# EAGLE design 3rdLayer-V2 (EAGLE 8.6.3)
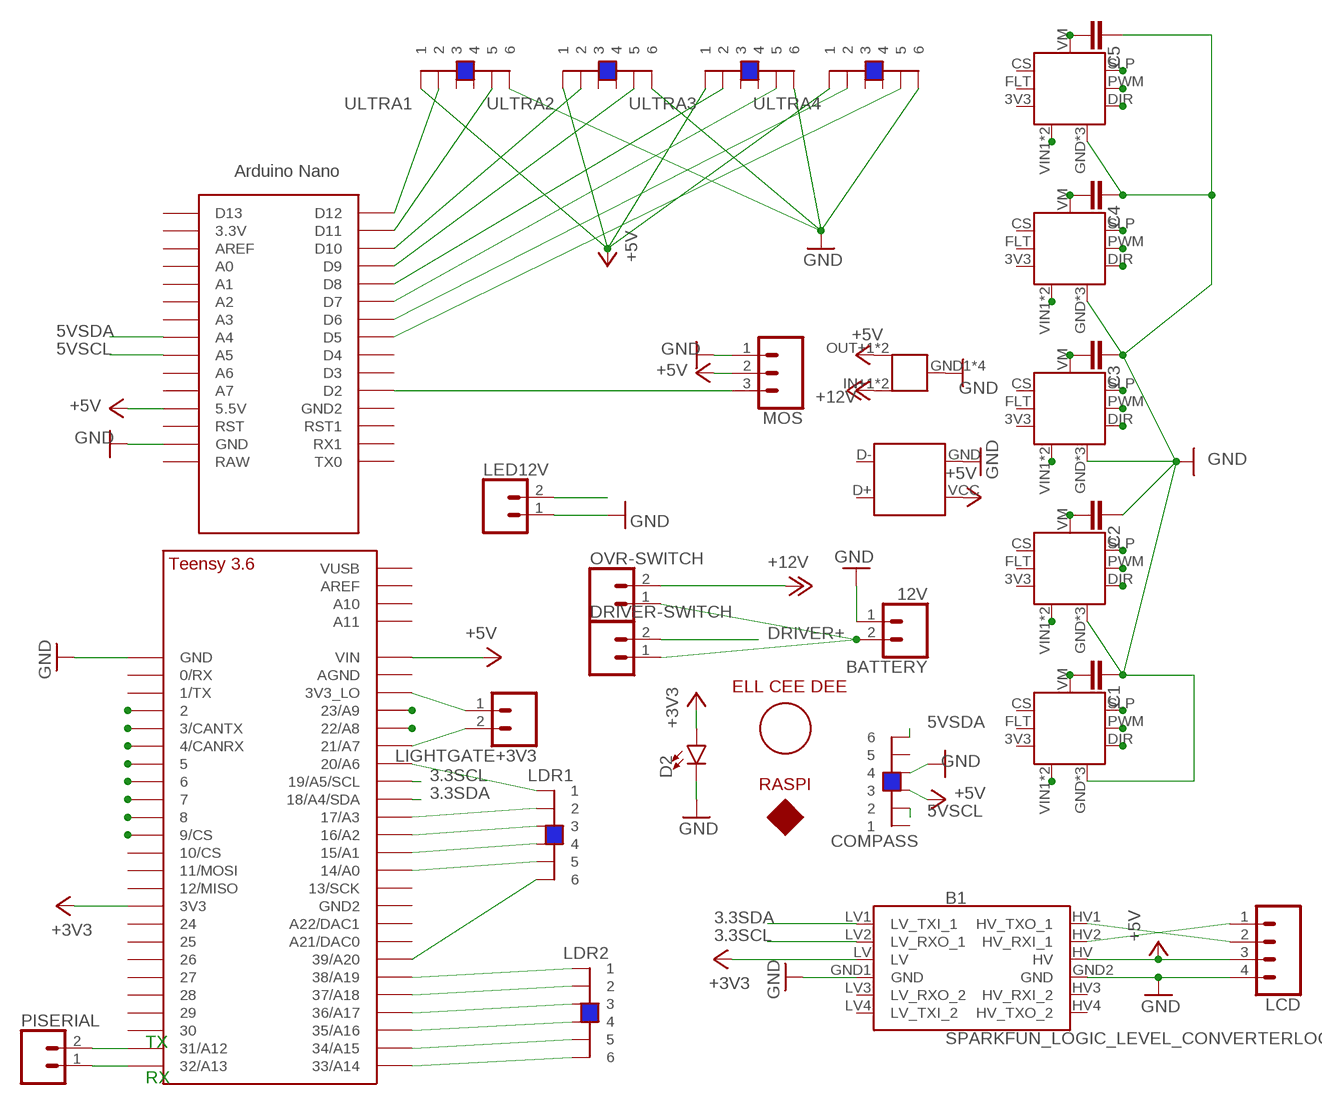
[diagram p0: schematic, sheet 1]

## Parts
B1  SPARKFUN_LOGIC_LEVEL_CONVERTERLOCK  [SPARKFUN_LOGIC_LEVEL_CONVERTER_LOCK]
BATTERY  12V  CONN_023.5MM_LOCK  [SCREWTERMINAL-3.5MM-2_LOCK]
C1  C5/7.2  [C5B7.2]
C2  C5/7.2  [C5B7.2]
C3  C5/7.2  [C5B7.2]
C4  C5/7.2  [C5B7.2]
C5  C5/7.2  [C5B7.2]
COMPASS  6P6C_FEMALESMD  [6P6C_FEMALE]
D2  LED-3MM-NO_SILK  [LED_3MM-NS]
DRIVER-SWITCH  CONN_023.5MM_LOCK  [SCREWTERMINAL-3.5MM-2_LOCK]
LCD  CONN_04LOCK_LONGPADS  [1X04_LOCK_LONGPADS]
LCD1  LCD-16X2SILK  [LCD-16X2]
LDR1  6P6C_FEMALESMD  [6P6C_FEMALE]
LDR2  6P6C_FEMALESMD  [6P6C_FEMALE]
LED12V  CONN_023.5MM_LOCK  [SCREWTERMINAL-3.5MM-2_LOCK]
LIGHTGATE+3V3  CONN_02LOCK_LONGPADS  [1X02_LOCK_LONGPADS]
MOS  CONN_03LOCK_LONGPADS  [1X03_LOCK_LONGPADS]
OVR-SWITCH  CONN_023.5MM_LOCK  [SCREWTERMINAL-3.5MM-2_LOCK]
PCB1  RPI3  [RPI3]
PISERIAL  CONN_02LOCK_LONGPADS  [1X02_LOCK_LONGPADS]
RPI  USBA  [USBA]
U$1  TEENSY_3.5/3.6_BASIC  [TEENSY_3.5/3.6_BASIC]
U$2  NANO  [NANO]
U$3  18V17  [18V17]
U$4  18V17  [18V17]
U$5  18V17  [18V17]
U$6  18V17  [18V17]
U$7  18V17  [18V17]
U$8  5VSTEPDOWN  [5VSTEPDOWN]
ULTRA1  6P6C_FEMALESMD  [6P6C_FEMALE]
ULTRA2  6P6C_FEMALESMD  [6P6C_FEMALE]
ULTRA3  6P6C_FEMALESMD  [6P6C_FEMALE]
ULTRA4  6P6C_FEMALESMD  [6P6C_FEMALE]

## Nets
3.3SCL: B1.LV2(LV_RXO_1) U$1.19/A5/SCL
3.3SDA: B1.LV1(LV_TXI_1) U$1.18/A4/SDA
5VSCL: B1.HV2(HV_RXI_1) COMPASS.2 LCD.1 U$2.A5
5VSDA: B1.HV1(HV_TXO_1) COMPASS.6 LCD.2 U$2.A4
+3V3: B1.LV D2.A U$1.3V3
+5V: B1.HV COMPASS.3 LCD.3 MOS.2 RPI.VCC U$1.VIN U$2.5V(5.5V) U$3.SLP U$4.SLP U$5.SLP U$6.SLP U$7.SLP U$8.OUT+1(5VOUT) U$8.OUT+2(5VOUT) ULTRA1.1 ULTRA2.1 ULTRA3.1 ULTRA4.1
+12V: OVR-SWITCH.2 U$8.IN+1(IN+) U$8.IN+2(IN+)
DIR1: U$1.6 U$3.DIR
DIR2: U$1.7 U$4.DIR
DIR3: U$1.8 U$5.DIR
DIR4: U$1.9/CS U$6.DIR
DIR5: U$1.22/A8 U$7.DIR
DRIVER+: DRIVER-SWITCH.2 LED12V.2 U$3.VIN1(VIN) U$3.VIN2(VIN) U$4.VIN1(VIN) U$4.VIN2(VIN) U$5.VIN1(VIN) U$5.VIN2(VIN) U$6.VIN1(VIN) U$6.VIN2(VIN) U$7.VIN1(VIN) U$7.VIN2(VIN)
GND: B1.GND1(GND) B1.GND2(GND) BATTERY.1 C1.1 C2.1 C3.1 C4.1 C5.1 COMPASS.4 D2.K(C) LCD.4 LED12V.1 MOS.1 RPI.GND U$1.GND U$2.GND U$3.GND U$3.GND1(GND) U$3.GND2(GND) U$4.GND U$4.GND1(GND) U$4.GND2(GND) U$5.GND U$5.GND1(GND) U$5.GND2(GND) U$6.GND U$6.GND1(GND) U$6.GND2(GND) U$7.GND U$7.GND1(GND) U$7.GND2(GND) U$8.GND1(GND) U$8.GND2(GND) U$8.GND3(GND) U$8.GND4(GND) ULTRA1.6 ULTRA2.6 ULTRA3.6 ULTRA4.6
N$1: LDR1.6 U$1.39/A20
N$2: PISERIAL.2 U$1.31/A12
N$3: PISERIAL.1 U$1.32/A13
N$4: MOS.3 U$2.D2
N$6: LDR1.5 U$1.14/A0
N$7: LDR1.4 U$1.15/A1
N$8: LDR1.3 U$1.16/A2
N$9: LDR1.2 U$1.17/A3
N$10: LDR1.1 U$1.20/A6
N$13: LIGHTGATE+3V3.2 U$1.21/A7
N$16: C1.2 U$3.VM
N$18: LDR2.1 U$1.38/A19
N$19: LDR2.2 U$1.37/A18
N$20: LDR2.3 U$1.36/A17
N$21: LDR2.4 U$1.35/A16
N$22: LDR2.5 U$1.34/A15
N$23: LDR2.6 U$1.33/A14
N$26: U$2.D12 ULTRA1.2
N$27: BATTERY.2 DRIVER-SWITCH.1 OVR-SWITCH.1
N$28: U$2.D11 ULTRA1.5
N$29: U$2.D10 ULTRA2.2
N$30: U$2.D9 ULTRA2.5
N$31: C2.2 U$4.VM
N$32: LIGHTGATE+3V3.1 U$1.3V3_LO
N$33: C3.2 U$5.VM
N$34: C4.2 U$6.VM
N$35: C5.2 U$7.VM
N$39: U$2.D8 ULTRA3.2
N$40: U$2.D7 ULTRA3.5
N$41: U$2.D6 ULTRA4.2
N$42: U$2.D5 ULTRA4.5
PWM1: U$1.2 U$3.PWM
PWM2: U$1.3/CANTX U$4.PWM
PWM3: U$1.4/CANRX U$5.PWM
PWM4: U$1.5 U$6.PWM
PWM5: U$1.23/A9 U$7.PWM
Unconnected: B1.HV3(HV_RXI_2) B1.HV4(HV_TXO_2) B1.LV3(LV_RXO_2) B1.LV4(LV_TXI_2) COMPASS.1 COMPASS.5 RPI.D+ RPI.D- U$1.0/RX U$1.1/TX U$1.10/CS U$1.11/MOSI U$1.12/MISO U$1.13/SCK U$1.21/DAC0(A21/DAC0) U$1.24 U$1.25 U$1.26 U$1.27 U$1.28 U$1.29 U$1.30 U$1.A10 U$1.A11 U$1.A22/DAC1 U$1.AGND U$1.AREF U$1.GND2 U$1.VUSB U$2.3.3V U$2.A0 U$2.A1 U$2.A2 U$2.A3 U$2.A6 U$2.A7 U$2.AREF U$2.D3 U$2.D4 U$2.D13 U$2.GND1(GND2) U$2.RAW U$2.RST U$2.RST1 U$2.RX1 U$2.TX0 U$3.3V3 U$3.CS U$3.FLT U$4.3V3 U$4.CS U$4.FLT U$5.3V3 U$5.CS U$5.FLT U$6.3V3 U$6.CS U$6.FLT U$7.3V3 U$7.CS U$7.FLT ULTRA1.3 ULTRA1.4 ULTRA2.3 ULTRA2.4 ULTRA3.3 ULTRA3.4 ULTRA4.3 ULTRA4.4

## Notes on the sheet
- TX
- RX

## Library data of the parts
B1 = SparkFun-Boards:SPARKFUN_LOGIC_LEVEL_CONVERTER: SparkFun Logic Level Converter -Bi-Directional This is the mechnical outline for the 3.3V - 5V bi directional logic level converter. *Note, the "LOCK" Package has the header pins staggered by an offset of 5 mils (off center line), so that when you slide a row of standard 0.1" headers into the PTH pads, it will hold position vertically. See the follwing turorial for more information on this type of special footprints: Sneaky Footprints <https://www.sparkfun.com/tutorials/114> SparkFun Products: SparkFun Logic Level Converter - Bi-Directional <https://www.sparkfun.com/products/12009>
BATTERY DRIVER-SWITCH LED12V OVR-SWITCH = SparkFun-Connectors:CONN_02: Multi connection point. Often used as Generic Header-pin footprint for 0.1 inch spaced/style header connections On any of the 0.1 inch spaced packages, you can populate with these: Break Away Headers - Straight <https://www.sparkfun.com/products/116> (PRT-00116) Break Away Male Headers - Right Angle <https://www.sparkfun.com/products/553> (PRT-00553) Female Headers <https://www.sparkfun.com/products/115> (PRT-00115) Break Away Headers - Machine Pin <https://www.sparkfun.com/products/117> (PRT-00117) Break Away Female Headers - Swiss Machine Pin <https://www.sparkfun.com/products/743> (PRT-00743) For SCREWTERMINALS and SPRING TERMINALS visit here: Screw Terimnals on SparkFun.com <https://www.sparkfun.com/search/results?term=Screw+Terminals> (5mm/3.5mm/2.54mm spacing) This device is also useful as a general connection point to wire up your design to another part of your project. Our various solder wires solder well into these plated through hole pads. Hook-Up Wire - Assortment (Stranded, 22 AWG) <https://www.sparkfun.com/products/11375> (PRT-11375) Hook-Up Wire - Assortment (Solid Core, 22 AWG) <https://www.sparkfun.com/products/11367> (PRT-11367) View the entire wire category on our website here <https://www.sparkfun.com/categories/141> Special notes: Molex polarized connector foot print use with: PRT-08233 with associated crimp pins and housings. 2.54_SCREWTERM for use with PRT-10571. 3.5mm Screw Terminal footprints for PRT-08084 5mm Screw Terminal footprints for use with PRT-08432; PROD_ID: CONN-08399
C1-C5 = capacitor-wima:C: CAPACITOR naming: grid - package width
COMPASS LDR1 LDR2 ULTRA1-ULTRA4 = Yijiano:6P6C_FEMALE
D2 = SparkFun-LED:LED: LED (Generic) Standard schematic elements and footprints for 5mm, 3mm, 1206, and 0603 sized LEDs. Generic LEDs with no color specified.
LCD = SparkFun-Connectors:CONN_04: Multi connection point. Often used as Generic Header-pin footprint for 0.1 inch spaced/style header connections On any of the 0.1 inch spaced packages, you can populate with these: Break Away Headers - Straight <https://www.sparkfun.com/products/116> (PRT-00116) Break Away Male Headers - Right Angle <https://www.sparkfun.com/products/553> (PRT-00553) Female Headers <https://www.sparkfun.com/products/115> (PRT-00115) Break Away Headers - Machine Pin <https://www.sparkfun.com/products/117> (PRT-00117) Break Away Female Headers - Swiss Machine Pin <https://www.sparkfun.com/products/743> (PRT-00743) For SCREWTERMINALS and SPRING TERMINALS visit here: Screw Terimnals on SparkFun.com <https://www.sparkfun.com/search/results?term=Screw+Terminals> (5mm/3.5mm/2.54mm spacing) This device is also useful as a general connection point to wire up your design to another part of your project. Our various solder wires solder well into these plated through hole pads. Hook-Up Wire - Assortment (Stranded, 22 AWG) <https://www.sparkfun.com/products/11375> (PRT-11375) Hook-Up Wire - Assortment (Solid Core, 22 AWG) <https://www.sparkfun.com/products/11367> (PRT-11367) View the entire wire category on our website here <https://www.sparkfun.com/categories/141> Special notes: Molex polarized connector foot print use with SKU : PRT-08231 with associated crimp pins and housings. 1MM SMD Version SKU: PRT-10208; PROD_ID: CONN-09696
LCD1 = SparkFun-Displays:LCD-16X2: Standard text-only 16x2 parallel input LCD Basic 16 character by 2 line display. Typically utilizes the extremely common HD44780 parallel interface chipset SparkFun Products: Basic 16x2 Green <https://www.sparkfun.com/products/255> Basic 8x2 Green <https://www.sparkfun.com/products/11122>; SF_ID: LCD-00255
LIGHTGATE+3V3 PISERIAL = SparkFun-Connectors:CONN_02: Multi connection point. Often used as Generic Header-pin footprint for 0.1 inch spaced/style header connections On any of the 0.1 inch spaced packages, you can populate with these: Break Away Headers - Straight <https://www.sparkfun.com/products/116> (PRT-00116) Break Away Male Headers - Right Angle <https://www.sparkfun.com/products/553> (PRT-00553) Female Headers <https://www.sparkfun.com/products/115> (PRT-00115) Break Away Headers - Machine Pin <https://www.sparkfun.com/products/117> (PRT-00117) Break Away Female Headers - Swiss Machine Pin <https://www.sparkfun.com/products/743> (PRT-00743) For SCREWTERMINALS and SPRING TERMINALS visit here: Screw Terimnals on SparkFun.com <https://www.sparkfun.com/search/results?term=Screw+Terminals> (5mm/3.5mm/2.54mm spacing) This device is also useful as a general connection point to wire up your design to another part of your project. Our various solder wires solder well into these plated through hole pads. Hook-Up Wire - Assortment (Stranded, 22 AWG) <https://www.sparkfun.com/products/11375> (PRT-11375) Hook-Up Wire - Assortment (Solid Core, 22 AWG) <https://www.sparkfun.com/products/11367> (PRT-11367) View the entire wire category on our website here <https://www.sparkfun.com/categories/141> Special notes: Molex polarized connector foot print use with: PRT-08233 with associated crimp pins and housings. 2.54_SCREWTERM for use with PRT-10571. 3.5mm Screw Terminal footprints for PRT-08084 5mm Screw Terminal footprints for use with PRT-08432
MOS = SparkFun-Connectors:CONN_03: Multi connection point. Often used as Generic Header-pin footprint for 0.1 inch spaced/style header connections On any of the 0.1 inch spaced packages, you can populate with these: Break Away Headers - Straight <https://www.sparkfun.com/products/116> (PRT-00116) Break Away Male Headers - Right Angle <https://www.sparkfun.com/products/553> (PRT-00553) Female Headers <https://www.sparkfun.com/products/115> (PRT-00115) Break Away Headers - Machine Pin <https://www.sparkfun.com/products/117> (PRT-00117) Break Away Female Headers - Swiss Machine Pin <https://www.sparkfun.com/products/743> (PRT-00743) Stackable Header - 3 Pin (Female, 0.1") <https://www.sparkfun.com/products/13875> (PRT-13875) For SCREWTERMINALS and SPRING TERMINALS visit here: Screw Terimnals on SparkFun.com <https://www.sparkfun.com/search/results?term=Screw+Terminals> (5mm/3.5mm/2.54mm spacing) This device is also useful as a general connection point to wire up your design to another part of your project. Our various solder wires solder well into these plated through hole pads. Hook-Up Wire - Assortment (Stranded, 22 AWG) <https://www.sparkfun.com/products/11375> (PRT-11375) Hook-Up Wire - Assortment (Solid Core, 22 AWG) <https://www.sparkfun.com/products/11367> (PRT-11367) View the entire wire category on our website here <https://www.sparkfun.com/categories/141> Special notes: Molex polarized connector foot print use with SKU : PRT-08232 with associated crimp pins and housings.
PCB1 = e14_Rpi3_RevA:RPI3: Device for Raspberry Pi 3 board created by Dave Young for www.element14.com More information and support community is available at https://www.element14.com/community/community/raspberry-pi
RPI = usbA:USBA
U$1 = Teensy356:TEENSY_3.5/3.6_BASIC
U$2 = Arduino-clone:NANO: Arduino Nano
U$3-U$7 = 18v17:18V17
U$8 = 18v17:5VSTEPDOWN

## Board
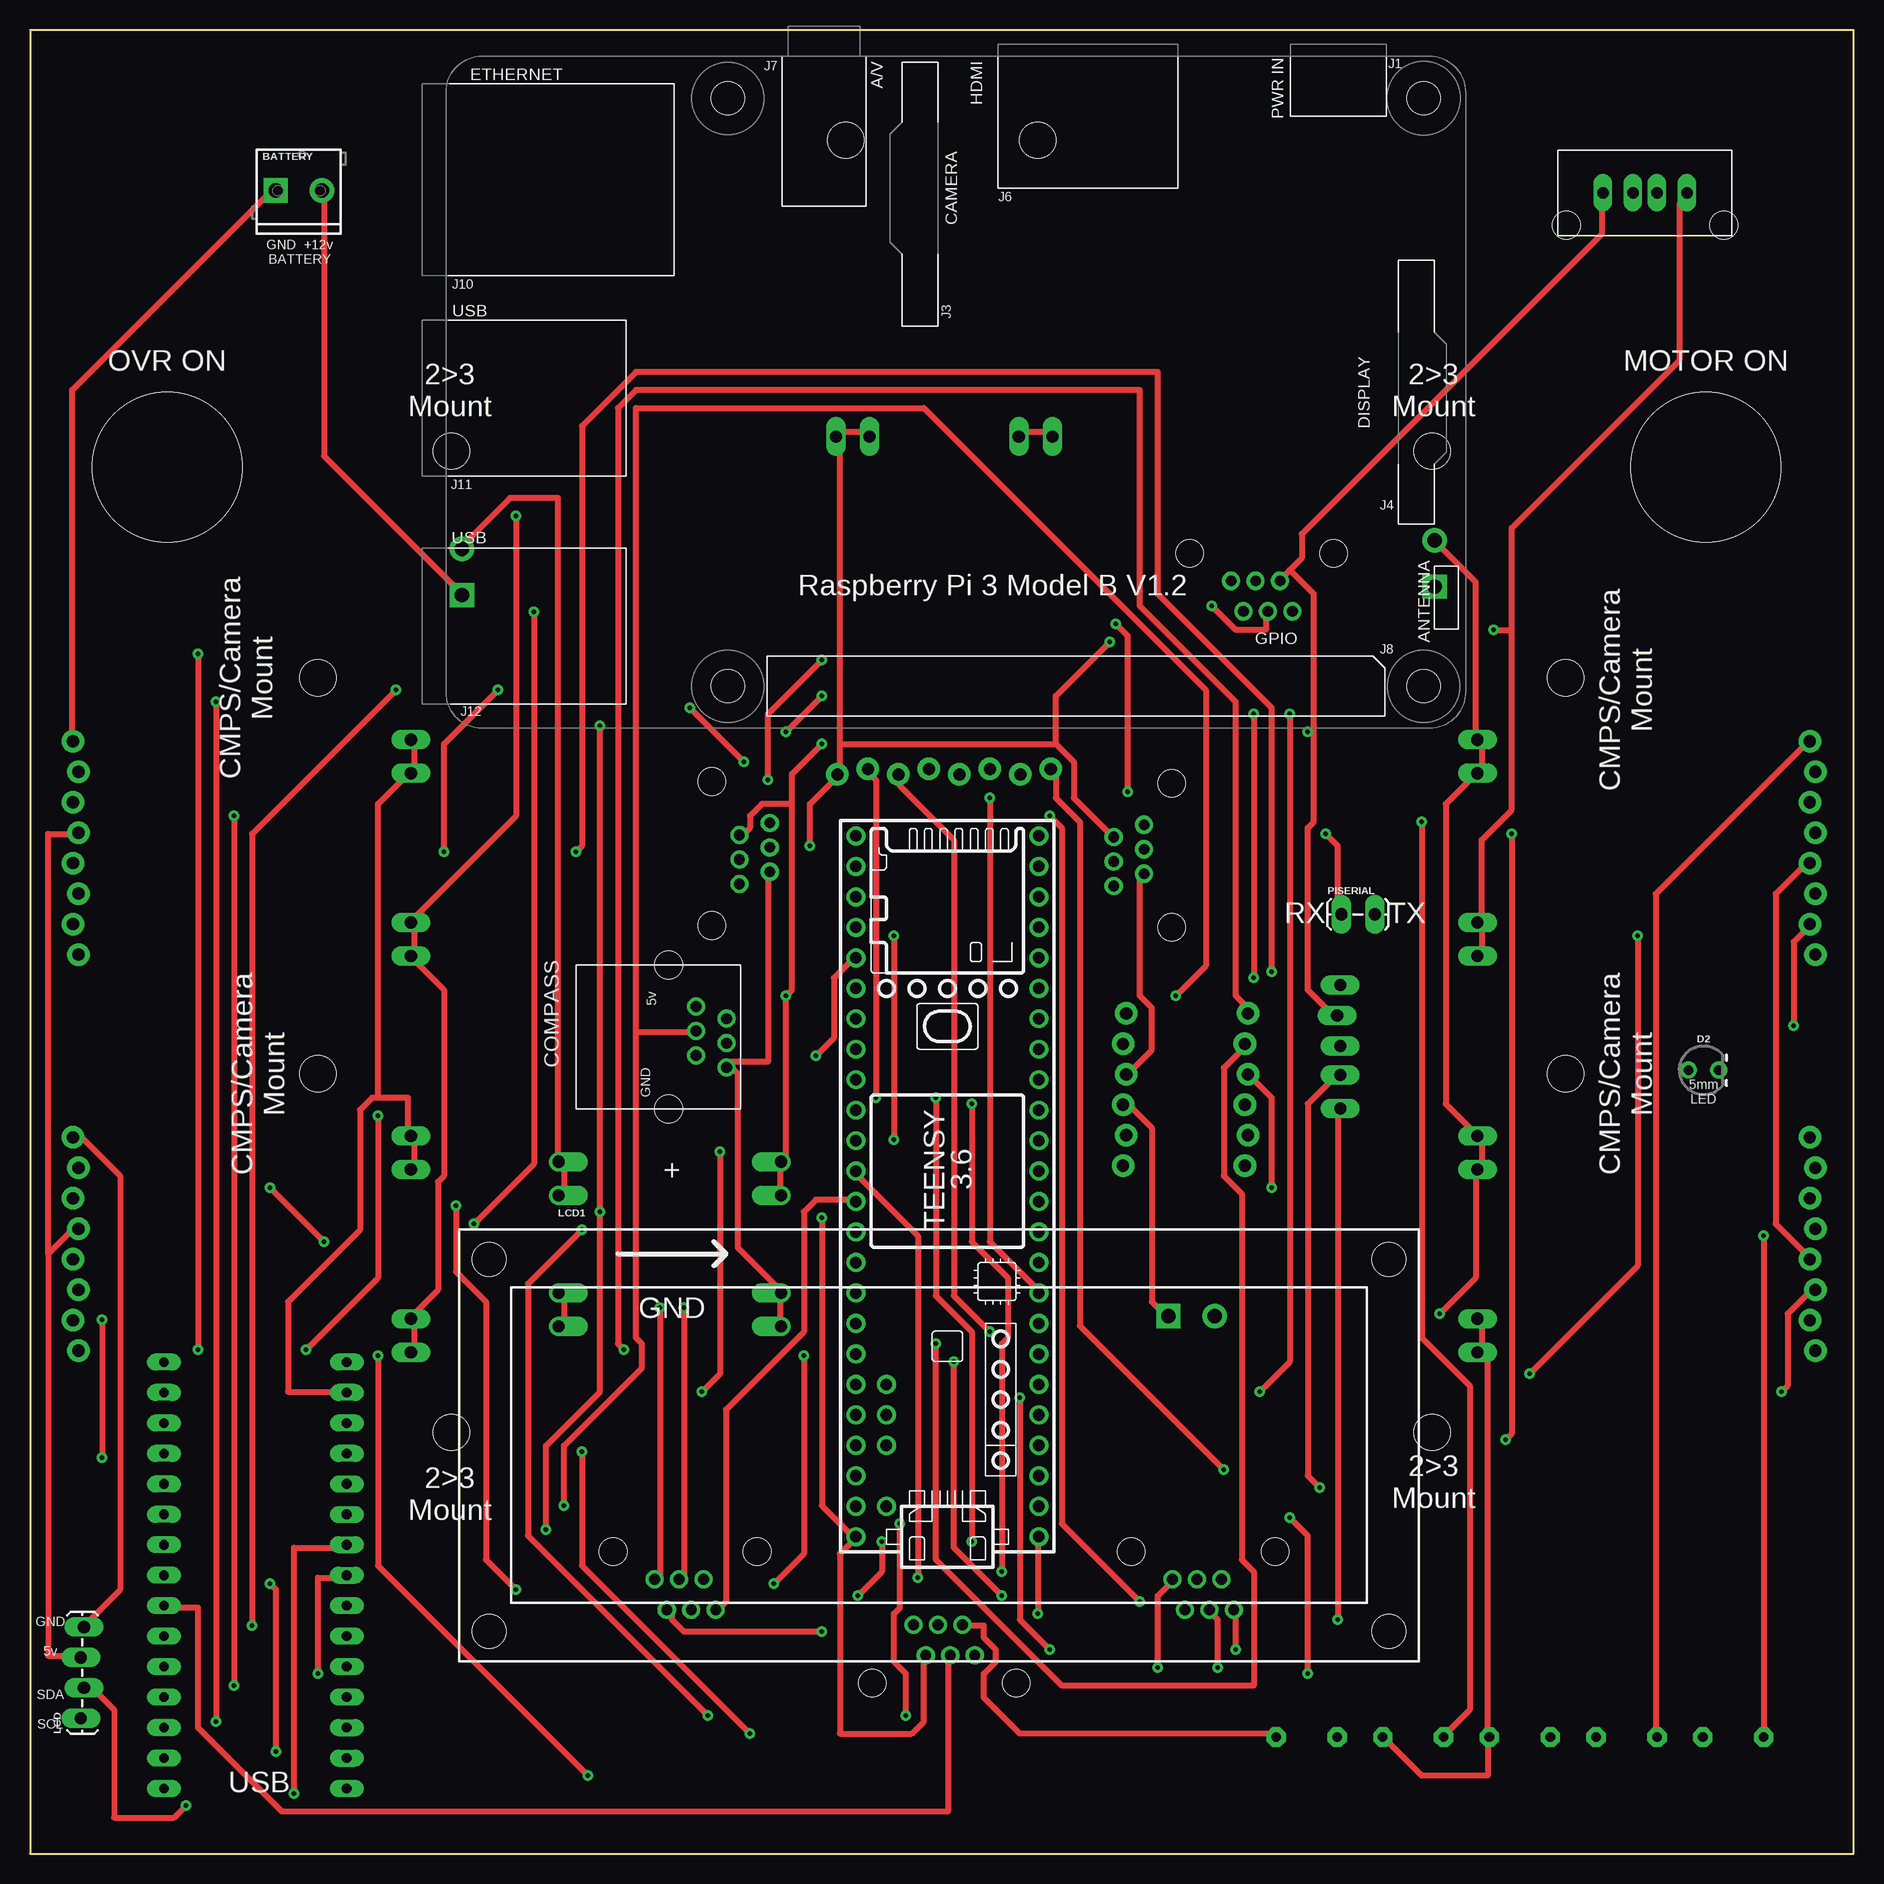
[diagram p1: board, top side]
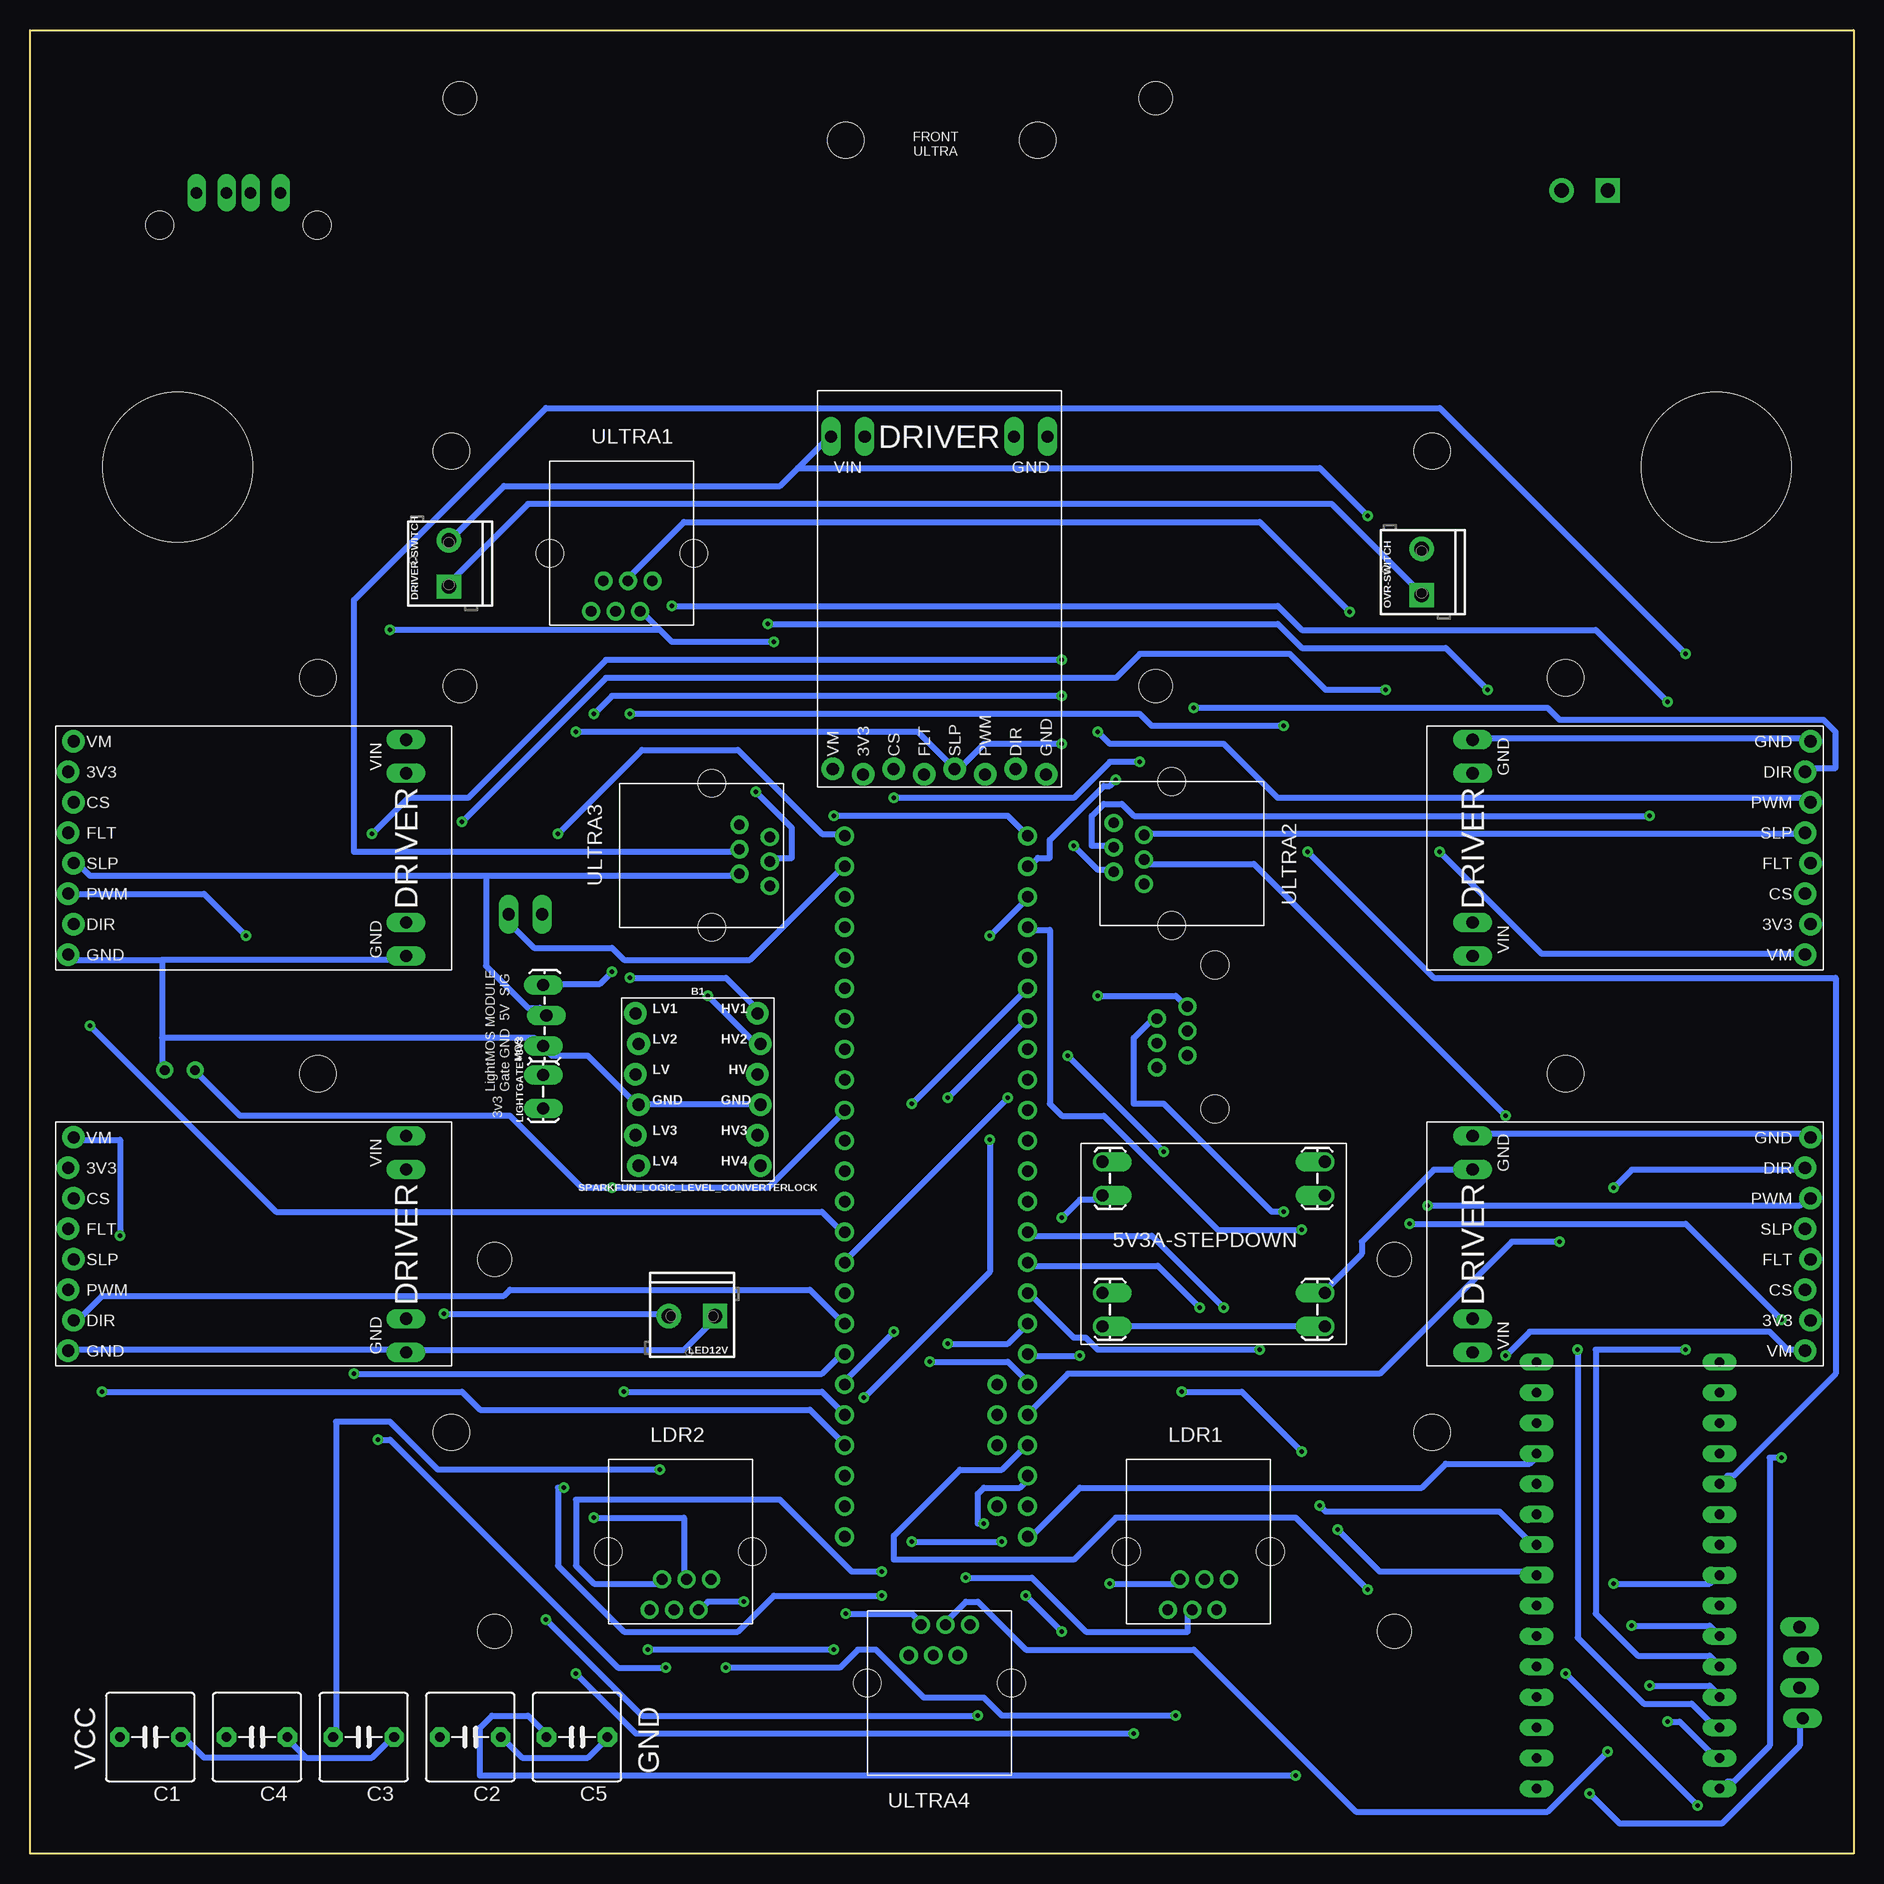
[diagram p2: board, bottom side, seen from below]

Size 152 x 152 mm. Coordinates in mm from the lower left corner, seen from the top.
Outline: 0,0 152,0 152,152 0,152 0,0
Copper layers (1*16): Top 0.035mm / dielectric 1.53mm / Bottom 0.035mm
Design rules "default *": minimum track width 20mil, minimum drill 0.35mm, track to track 20mil, track to pad 20mil, pad to pad 20mil, via to via 20mil, smd to smd 10mil, copper to edge 40mil, drill to drill 10mil, minimum pad ring 12mil, minimum via ring 10mil, stop-mask expansion 4mil, vias tented up to drill 25mil, thermal gap 10mil
Holes 3 mm at 116.88,116.89 35.12,116.89 116.88,35.11 35.12,35.11 84,142.81 68,142.81 128,98 128,65 24,65 24,98
Holes 12.5 mm at 11.43,115.57 139.7,115.57

### Footprints (pad centres in the part's own frame; a part is rotated, then mirrored left to right if it is on the bottom)
SPARKFUN_LOGIC_LEVEL_CONVERTER_LOCK = drill 1.016 pad 1.88: GND1 -4.953,-1.27; GND2 5.207,-1.27; HV 4.953,1.27; HV1 4.953,6.35; HV2 5.207,3.81; HV3 4.953,-3.81; HV4 5.207,-6.35; LV -5.207,1.27; LV1 -5.207,6.35; LV2 -4.953,3.81; LV3 -5.207,-3.81; LV4 -4.953,-6.35
SCREWTERMINAL-3.5MM-2_LOCK = drill 1.2 pad 2.032 square: 1 -0.178,0 | drill 1.2 pad 2.032: 2 3.678,0
C5B7.2 = drill 0.813 pad 1.6 octagon: 1 -2.54,0; 2 2.54,0
6P6C_FEMALE = drill 0.9 pad 1.3: 1 -1.53,1.27; 2 0.51,1.27; 3 2.55,1.27; 4 -2.55,-1.27; 5 -0.51,-1.27; 6 1.53,-1.27 | hole 2.3: -6,3.57; 6,3.57
LED_3MM-NS = drill 0.813: A -1.27,0; K 1.27,0
1X04_LOCK_LONGPADS = drill 1.016 long: 1 0,0; 2 2.54,-0.254; 3 5.08,0; 4 7.62,-0.254
LCD-16X2 = hole 2.8: -37.5,15.5; -37.5,-15.5; 37.5,15.5; 37.5,-15.5
1X02_LOCK_LONGPADS = drill 1.016 long: 1 -0.127,0; 2 2.667,0
1X03_LOCK_LONGPADS = drill 1.016 long: 1 0,0; 2 2.54,-0.254; 3 5.08,0
RPI3 = hole 2.75: 3.5,3.5; 61.5,3.5; 3.5,52.5; 61.5,52.5
USBA = drill 0.95 long: D+ 1,0; D- -1,0; GND 3.5,0; VCC -3.5,0 | hole 2.3: 6.57,-2.71; -6.57,-2.71
TEENSY_3.5/3.6_BASIC = drill 0.965: 0/RX -25.4,-7.62; 1/TX -22.86,-7.62; 2 -20.32,-7.62; 3/CANTX -17.78,-7.62; 3V3 7.62,-7.62; 3V3_LO -22.86,7.62; 4/CANRX -15.24,-7.62; 5 -12.7,-7.62; 6 -10.16,-7.62; 7 -7.62,-7.62; 8 -5.08,-7.62; 9/CS -2.54,-7.62; 10/CS 0,-7.62; 11/MOSI 2.54,-7.62; 12/MISO 5.08,-7.62; 13/SCK 5.08,7.62; 14/A0 2.54,7.62; 15/A1 0,7.62; 16/A2 -2.54,7.62; 17/A3 -5.08,7.62; 18/A4/SDA -7.62,7.62; 19/A5/SCL -10.16,7.62; 20/A6 -12.7,7.62; 21/A7 -15.24,7.62; 21/DAC0 12.7,7.62; 22/A8 -17.78,7.62; 23/A9 -20.32,7.62; 24 10.16,-7.62; 25 12.7,-7.62; 26 15.24,-7.62; 27 17.78,-7.62; 28 20.32,-7.62; 29 22.86,-7.62; 30 25.4,-7.62; 31/A12 27.94,-7.62; 32/A13 30.48,-7.62; 33/A14 30.48,7.62; 34/A15 27.94,7.62; 35/A16 25.4,7.62; 36/A17 22.86,7.62; 37/A18 20.32,7.62; 38/A19 17.78,7.62; 39/A20 15.24,7.62; A10 -17.78,5.08; A11 -15.24,5.08; A22/DAC1 10.16,7.62; AGND -25.4,7.62; AREF -20.32,5.08; GND -27.94,-7.62; GND2 7.62,7.62; VIN -27.94,7.62; VUSB -25.4,5.08
NANO = drill 0.8 long: 3.3V -10.16,24.13; 5V -10.16,-1.27; A0 -10.16,19.05; A1 -10.16,16.51; A2 -10.16,13.97; A3 -10.16,11.43; A4 -10.16,8.89; A5 -10.16,6.35; A6 -10.16,3.81; A7 -10.16,1.27; AREF -10.16,21.59; D2 5.08,1.27; D3 5.08,3.81; D4 5.08,6.35; D5 5.08,8.89; D6 5.08,11.43; D7 5.08,13.97; D8 5.08,16.51; D9 5.08,19.05; D10 5.08,21.59; D11 5.08,24.13; D12 5.08,26.67; D13 -10.16,26.67; GND -10.16,-6.35; GND1 5.08,-1.27; RAW -10.16,-8.89; RST -10.16,-3.81; RST1 5.08,-3.81; RX1 5.08,-6.35; TX0 5.08,-8.89
18V17 = drill 1.016 pad 1.88: 3V3 16.51,31.979; CS 13.97,31.521; DIR 3.81,31.521; FLT 11.43,31.979; GND 1.27,31.979; PWM 6.35,31.979; SLP 8.89,31.521; VM 19.05,31.521 | drill 1.016 long: GND1 1.143,3.81; GND2 3.937,3.81; VIN1 16.383,3.81; VIN2 19.177,3.81
5VSTEPDOWN = drill 1.016 offset: GND1 -9.273,6.859; GND2 -9.272,4.065; GND3 9.27,6.858; GND4 9.271,4.064; IN+1 -9.271,-4.065; IN+2 -9.27,-6.859; OUT+1 9.271,-4.065; OUT+2 9.272,-6.859

### Placement (x,y rotation side)
B1  96.32,63.68 0 bottom
BATTERY  20.66,138.61 0 top
C1  141.97,9.7 180 bottom
C2  115.3,9.7 180 bottom
C3  124.19,9.7 180 bottom
C4  133.08,9.7 180 bottom
C5  106.41,9.7 180 bottom
COMPASS  56.79,68.06 90 top
D2  139.51,65.3 0 top
DRIVER-SWITCH  117.09,105.78 90 bottom
LCD  4.24,11.26 90 top
LCD1  75.77,34.03 0 top
LDR1  54.61,21.59 0 bottom
LDR2  97.79,21.59 0 bottom
LED12V  95.07,44.79 180 bottom
LIGHTGATE+3V3  109.22,62.23 90 bottom
MOS  109.22,67.31 90 bottom
OVR-SWITCH  36,105.07 90 bottom
PCB1  119.67,149.81 180 top
PISERIAL  109.43,78.29 0 top
RPI  134.62,138.43 0 top
U$1  76.47,54.34 90 top
U$2  16.24,32.08 180 top
U$3  116.84,40.64 90 bottom
U$4  35.56,93.98 270 bottom
U$5  66.04,121.92 180 bottom
U$6  116.84,73.66 90 bottom
U$7  35.56,60.96 270 bottom
U$8  53.34,50.8 180 bottom
ULTRA1  102.67,104.81 0 bottom
ULTRA2  60.4,83.36 270 bottom
ULTRA3  91.6,83.2 90 bottom
ULTRA4  76.2,17.78 180 bottom

### Tracks (layer width: path | path; a pad name or v marks a point on that pad's centre or on a via)
3.3SCL  (via drill 0.35)
  Top 0.508: v75.5,42.5 75.5,24.5 86,14 102,14 102,23.5 101,24.5 101,55 99.5,56.5 99.5,65.5 101,67 B1.LV2
  Bottom 0.508: v75.5,42.5 70.5,42.5 69,44 U$1.19/A5/SCL
3.3SDA  (via drill 0.35)
  Top 0.508: v49.5,42 49,42.5 49,120.5 50.5,122 92.5,122 92.5,104 100.5,96 100.5,71.5 101.5,70.5 B1.LV1
  Bottom 0.508: v49.5,42 63,42 64,43 65,43 68.5,46.5 U$1.18/A4/SDA
5VSCL  (via drill 0.35)
  Top 0.508: v22,5 22,25.5 26,25.5 U$2.A5 | 50.5,68.5 55.5,68.5 COMPASS.2 | 50.5,68.5 50.5,43 51,42.5 51,40.5 44.5,34 v44.5,29 | v95.5,71.5 98,74 98,97 74.5,120.5 50.5,120.5 50.5,68.5
  Bottom 0.508: v22,5 19.5,2.5 11,2.5 4.5,9 4.5,11 LCD.1 | v44.5,29 44,28.5 29.5,28.5 27,26 26.5,26 U$2.A5 | v95.5,71.5 91.5,67.5 B1.HV2
5VSDA  (via drill 0.35)
  Top 0.508: v24,15 24,23 26,23 U$2.A4 | v13,4 12,3 7,3 7,12 5.5,13.5 4.5,13.5 LCD.2 | v43,27 43,34 47.5,38.5 v47.5,53.5 v47.5,94 | v102,95 v102,73
  Bottom 0.508: v13,4 v24,15 | v47.5,53.5 48.5,53.5 57.5,62.5 60,62.5 60,68 58.5,69.5 COMPASS.6 | v43,27 39.5,23.5 26.5,23.5 U$2.A4 | v102,73 94,73 91.5,70.5 B1.HV1 | v102,95 59.5,95 58.5,94 v47.5,94
+3V3  (via drill 0.35)
  Top 0.508: v103.5,55.5 103.5,63 102,64.5 B1.LV
  Bottom 0.508: D2.A 138,65 134.5,61.5 112,61.5 106,55.5 v103.5,55.5 90.5,55.5 84.5,61.5 U$1.3V3
+5V  (via drill 0.35)
  Top 0.508: 105,107 106,108 106,110 131,135 131,138 RPI.VCC | 105,107 104.5,106.5 ULTRA1.1 | U$3.SLP 148,50 145.5,52.5 145.5,80 148,82.5 U$6.SLP | ULTRA3.1 92.5,81.5 92.5,71.5 93.5,70.5 93.5,67 91.5,65 B1.HV | 105,107 107,105 107,93.5 | 107,93.5 107,86 106.5,85.5 106.5,72 108.5,70 MOS.2 | ULTRA4.1 74.5,16.5 74.5,11 73.5,10 67.5,10 67.5,25 68.5,26 U$1.VIN 68.5,26.5 66,29 v66,53 | 63.5,87.5 61,87.5 60,86.5 60,85.5 59.5,85 ULTRA2.1 | 63.5,87.5 63.5,72 v63,71.5 63,58 U$8.OUT+2 62.5,57.5 62.5,55 U$8.OUT+1 | v66,92.5 63.5,90 63.5,87.5 | 1.5,50 1.5,16.5 4,16.5 LCD.3 | 1.5,50 4,52.5 U$7.SLP | 1.5,50 1.5,85 4,85 U$4.SLP | v106.5,93.5 107,93.5
  Bottom 0.508: 114,81.5 114,74 110.5,70.5 109.5,70.5 109,70 MOS.2 | 114,81.5 93,81.5 ULTRA3.1 | 114,81.5 147,81.5 148,82.5 U$6.SLP | U$2.5V 26.5,33 27,32.5 34,32.5 36,30.5 64.5,30.5 68.5,26.5 U$1.VIN | v63,71.5 56.5,71.5 56,71 COMPASS.3 | v66,92.5 72.5,92.5 74.5,90.5 U$5.SLP 75,90.5 78,93.5 v106.5,93.5 | ULTRA2.1 59,85 4.5,85 U$4.SLP | v66,53 64.5,54.5 63,54.5 U$8.OUT+1
+12V
  Top 0.508: U$8.IN+1 44.5,55 44.5,57.5 U$8.IN+2 44,58 44,113 40,113 36,109 OVR-SWITCH.2
DIR1
  Bottom 0.508: U$1.6 84.5,44.5 87,47 112,47 112.5,46.5 146,46.5 148,44.5 U$3.DIR
DIR2  (via drill 0.35)
  Top 0.508: v80,88 80,51 84,47 U$1.7 | v55,95.5 v59.5,91
  Bottom 0.508: v80,88 65,88 62,91 v59.5,91 | v55,95.5 25.5,95.5 24.5,94.5 2.5,94.5 1.5,93.5 1.5,90.5 4,90.5 U$4.DIR
DIR3  (via drill 0.35)
  Top 0.508: v70.5,63 70.5,89.5 70,90 U$5.DIR
  Bottom 0.508: v70.5,63 84,49.5 U$1.8
DIR4  (via drill 0.35)
  Top 0.508: v147,69 147,76 148,77 U$6.DIR
  Bottom 0.508: v147,69 131.5,53.5 86,53.5 84.5,52 U$1.9/CS
DIR5  (via drill 0.35)
  Top 0.508: v20,55.5 v24.5,51
  Bottom 0.508: v24.5,51 28.5,51 39.5,40 65.5,40 68.5,37 U$1.22/A8 | v20,55.5 18.5,57 4.5,57 U$7.DIR
DRIVER+  (via drill 0.35)
  Top 0.508: v117.5,45 120.5,48 120.5,57 U$3.VIN1 121,57.5 121,59.5 U$3.VIN2 120.5,60 118,62.5 118,87.5 120.5,90 U$6.VIN1 121,90.5 121,92.5 U$6.VIN2 120.5,93 120.5,106 117.5,109 DRIVER-SWITCH.2 | U$7.VIN2 32,42 32,44.5 U$7.VIN1 32,45 34,47 34,56 34.5,56.5 34.5,72 32,74.5 U$4.VIN2 32,75 32,77.5 U$4.VIN1 32,78 40.5,86.5 v40.5,111.5 | U$5.VIN1 82.5,118.5 85,118.5 U$5.VIN2
  Bottom 0.508: v117.5,45 99,45 LED12V.2 | 88,115.5 89.5,114 112.5,114 117,109.5 DRIVER-SWITCH.2 | 88,115.5 85.5,118 U$5.VIN2 | v40.5,111.5 44.5,115.5 88,115.5
GND  (via drill 0.35)
  Top 0.508: 123.5,102 123.5,87 121,84.5 121,78 U$6.GND2 121,77.5 121,75 U$6.GND1 | 123.5,102 123.5,110.5 137.5,124.5 137.5,137.5 138,138 RPI.GND | LED12V.1 94.5,45 93.5,46 93.5,60.5 91.5,62.5 B1.GND2 | U$3.GND2 121,44.5 121,42 U$3.GND1 121,41.5 121.5,41 121.5,10 C3.1 121.5,9.5 121.5,6.5 116,6.5 113,9.5 C2.1 | v84,20 84,26 U$1.GND | ULTRA4.6 78,19 79.5,19 79.5,18 80.5,17 80.5,16 79.5,15 79.5,13 82.5,10 103.5,10 C5.1 | U$4.GND1 32,92.5 32,90.5 U$4.GND2 31.5,90 29,87.5 29,63 | BATTERY.1 20,138.5 3.5,122 3.5,93 U$4.GND | U$5.GND2 69.5,118.5 67.5,118.5 U$5.GND1 67.5,118 67.5,92.5 | 85.5,92.5 87,91 87,88 90,85 ULTRA3.6 | 67.5,92.5 85.5,92.5 | 67.5,92.5 67.5,90 U$5.GND 67,89.5 65,87.5 v65,84 | v90,101 85.5,96.5 85.5,92.5 | ULTRA2.6 61.5,81.5 61.5,66 58.5,66 COMPASS.4 58.5,65.5 59,65 59,50.5 62.5,47 U$8.GND4 62.5,46.5 62.5,44 U$8.GND3 | U$8.GND1 44.5,44 44.5,46.5 U$8.GND2 | 29,63 31.5,63 31.5,60 U$7.GND1 32,59.5 32,57.5 U$7.GND2 | 29,63 28.5,63 27.5,62 27.5,52 21.5,46 21.5,38.5 26,38.5 U$2.GND | LCD.4 4.5,19 7.5,22 7.5,56.5 4,60 U$7.GND | v122,102 123.5,102
  Bottom 0.508: 141,74.5 141,68 | 141,68 141,65.5 D2.K | 141,74.5 148.5,74.5 U$6.GND | 141,74.5 121,74.5 U$6.GND1 | B1.GND2 91.5,62.5 101,62.5 B1.GND1 101.5,62.5 105.5,66.5 108.5,66.5 109,67 MOS.1 109.5,67.5 110,68 141,68 | U$3.GND 148.5,42 121,42 U$3.GND1 120.5,42 97.5,42 95,44.5 LED12V.1 | v84,20 78.5,20 78,19.5 ULTRA4.6 | C5.1 104,9.5 105.5,8 111,8 112.5,9.5 C2.1 | 129,8 123.5,8 122,9.5 C3.1 | 129,8 130.5,9.5 C4.1 | 129,8 137.5,8 139,9.5 C1.1 | U$4.GND 4,93 31.5,93 U$4.GND1 | 99.5,102 98.5,101 v90,101 | 99.5,102 101,103.5 ULTRA1.6 | U$8.GND1 44.5,44 62.5,44 U$8.GND3 | U$7.GND1 31.5,60 4,60 U$7.GND | U$8.GND2 44,47 41,50 41,51 35,57 32,57 U$7.GND2 | v65,84 63,82 62,82 ULTRA2.6 | 99.5,102 v122,102
N$1  (via drill 0.35)
  Top 0.508: v66,18.5 54.5,18.5 53.5,19.5 53.5,20 LDR1.6 | v69,21.5 71,23.5 v71,26 | v78.5,26 78.5,43.5 75.5,46.5 v75.5,63
  Bottom 0.508: v69,21.5 v66,18.5 | v78.5,26 v71,26 | v75.5,63 69,69.5 U$1.39/A20
N$2
  Bottom 0.508: U$1.31/A12 84.5,82 92,74.5 102.5,74.5 103.5,75.5 110,75.5 112.5,78 PISERIAL.2
N$3  (via drill 0.35)
  Top 0.508: v108,85 109,84 109,78.5 PISERIAL.1
  Bottom 0.508: v108,85 101,92 93,92 86,85 84.5,85 U$1.32/A13
N$4  (via drill 0.35)
  Top 0.508: v45.5,83.5 46,84 46,119 50.5,123.5 94,123.5 94,105 103.5,95.5 v103.5,73.5
  Bottom 0.508: v45.5,83.5 35,73 1.5,73 1.5,40 10,31.5 10.5,31.5 11,31 U$2.D2 | v103.5,73.5 104.5,72.5 109,72.5 MOS.3
N$6  (via drill 0.35)
  Top 0.508: v74,23 74,51.5 69,56.5 U$1.14/A0
  Bottom 0.508: v74,23 68.5,23 64,18.5 55.5,18.5 55.5,20 LDR1.5
N$7
  Top 0.508: LDR1.4 57.5,20.5 58,21 58,37 64.5,43.5 64.5,53.5 65.5,54.5 68.5,54.5 U$1.15/A1
N$8  (via drill 0.35)
  Top 0.508: v52.5,45.5 52.5,23 LDR1.3
  Bottom 0.508: v52.5,45.5 58.5,51.5 68.5,51.5 U$1.16/A2
N$9  (via drill 0.35)
  Top 0.508: v54.5,45.5 54.5,23 LDR1.2
  Bottom 0.508: v54.5,45.5 58,49 68.5,49 U$1.17/A3
N$10  (via drill 0.35)
  Top 0.508: v62,22.5 64.5,25 v64.5,41.5
  Bottom 0.508: v62,22.5 56.5,22.5 LDR1.1 | v64.5,41.5 68.5,41.5 U$1.20/A6
N$13  (via drill 0.35)
  Top 0.508: v77,41 77,25.5 v81,21.5 | v107.5,30.5 106.5,31.5 106.5,62.5 109,65 LIGHTGATE+3V3.2
  Bottom 0.508: v77,41 70.5,41 69,39.5 U$1.21/A7 | v81,21.5 90,21.5 93,18.5 102.5,18.5 108,24 108,30.5 v107.5,30.5
N$16  (via drill 0.35)
  Top 0.508: v144.5,51.5 144.5,10 C1.2
  Bottom 0.508: v144.5,51.5 144.5,59.5 148,59.5 U$3.VM
N$18  (via drill 0.35)
  Top 0.508: v81,23.5 81,42.5 81.5,43 81.5,48 78.5,51 v78.5,62.5
  Bottom 0.508: v81,23.5 83.5,23.5 89.5,29.5 106.5,29.5 106.5,24 105,22.5 99.5,22.5 LDR2.1 | v78.5,62.5 69,72 U$1.38/A19
N$19  (via drill 0.35)
  Top 0.508: v105,28 106.5,26.5 v106.5,15 | v60,10 46,24 v46,33.5 | v56,38.5 57.5,40 v57.5,58.5 | v65.5,66.5 67,68 67,73 68.5,74.5 U$1.37/A18
  Bottom 0.508: v105,28 97.5,28 97.5,23 LDR2.2 | v106.5,15 101.5,10 v60,10 | v46,33.5 51,38.5 v56,38.5 | v65.5,66.5 v57.5,58.5
N$20  (via drill 0.35)
  Top 0.508: v94,15.5 94,21.5 95,22.5 LDR2.3 | v56.5,11.5 41.5,26.5 41.5,47.5 v46,52
  Bottom 0.508: v94,15.5 84.5,15.5 83,17 81.5,17 77.5,13 72.5,13 71,11.5 v56.5,11.5 | v46,52 53,52 62.5,61.5 66,61.5 67,62.5 67,77 68.5,77 U$1.36/A17
N$21  (via drill 0.35)
  Top 0.508: v100.5,17 100.5,20 LDR2.4 | v85,17 82.5,19.5 v82.5,38 | v72,76.5 v72,59.5
  Bottom 0.508: v85,17 v100.5,17 | v82.5,38 72,48.5 v72,59.5 | v72,76.5 69,79.5 U$1.35/A16
N$22  (via drill 0.35)
  Top 0.508: v99,15.5 99,19.5 98.5,20 LDR2.5 | v123,34.5 123.5,35 v123.5,85 | v66,99.5 61.5,95 v61.5,89.5
  Bottom 0.508: v99,15.5 103,15.5 122,34.5 v123,34.5 | v123.5,85 120.5,88 115.5,88 104,99.5 v66,99.5 | v61.5,89.5 62,89 62.5,89 67,84.5 67,83 68,83 68.5,82.5 U$1.34/A15
N$23  (via drill 0.35)
  Top 0.508: v92.5,21 86,27.5 86,85.5 v85,86.5
  Bottom 0.508: v92.5,21 95.5,21 96,20.5 LDR2.6 | v85,86.5 70.5,86.5 69,85 U$1.33/A14
N$26  (via drill 0.35)
  Top 0.508: v6,44.5 v6,33 | v37,52.5 42,57.5 v42,103.5
  Bottom 0.508: v6,33 7,33 7,9 10,6 10.5,6 11,5.5 U$2.D12 | v6,44.5 14,52.5 v37,52.5 | v42,103.5 49.5,111 97.5,111 102,106.5 ULTRA1.2
N$27
  Top 0.508: OVR-SWITCH.1 36,105 24.5,116.5 24.5,138.5 BATTERY.2
  Bottom 0.508: DRIVER-SWITCH.1 117,106 110.5,112.5 43.5,112.5 36,105 OVR-SWITCH.1
N$28  (via drill 0.35)
  Top 0.508: v15.5,96 v15.5,11 | v98.5,104 100.5,102 103,102 103,103.5 ULTRA1.5
  Bottom 0.508: v15.5,11 14.5,11 11.5,8 U$2.D11 | v15.5,96 21.5,102 46,102 48,104 v98.5,104
N$29  (via drill 0.35)
  Top 0.508: v23,42 29,48 v29,61.5
  Bottom 0.508: v23,42 23,18 17.5,12.5 13.5,12.5 11.5,10.5 U$2.D10 | v29,61.5 50,82.5 59,82.5 ULTRA2.2
N$30  (via drill 0.35)
  Top 0.508: v17,86.5 v17,14
  Bottom 0.508: v17,14 12,14 11.5,13.5 U$2.D9 | v17,86.5 60,86.5 61,87.5 62.5,87.5 63.5,86.5 63.5,84 62,84 ULTRA2.5
N$31  (via drill 0.35)
  Top 0.508: v116,86 116,43 120,39 120,12 118,10 C2.2 | v39,97 34.5,92.5 v34.5,83.5
  Bottom 0.508: v116,86 104,98 61.5,98 59.5,100 47,100 44,97 v39,97 | v34.5,83.5 26,75 4.5,75 U$4.VM
N$32  (via drill 0.35)
  Top 0.508: v72.5,27.5 72.5,20.5 72,20 72,16 73,15 v73,11.5 | v109,19.5 109,62 LIGHTGATE+3V3.1
  Bottom 0.508: v72.5,27.5 73,27.5 73,30 72.5,30.5 69.5,30.5 69,31 U$1.3V3_LO | v73,11.5 101,11.5 v109,19.5
N$33  (via drill 0.35)
  Top 0.508: v99.5,32 87.5,44 87.5,86 85.5,88 85.5,90 U$5.VM
  Bottom 0.508: v99.5,32 118,32 122,36 126.5,36 126.5,10 C3.2
N$34
  Top 0.508: C4.2 135.5,10 135.5,80 148,92.5 U$6.VM
N$35  (via drill 0.35)
  Top 0.508: v46.5,6.5 29,24 v29,41.5
  Bottom 0.508: v46.5,6.5 114.5,6.5 114.5,10.5 113.5,11.5 110.5,11.5 109,10 C5.2 | v29,41.5 27,43.5 7,43.5 5.5,42 4.5,42 U$7.VM
N$39  (via drill 0.35)
  Top 0.508: v14,100 v14,42
  Bottom 0.508: v14,42 21.5,42 21.5,20 18,16.5 12,16.5 11.5,16 U$2.D8 | v14,100 34.5,120.5 109,120.5 125,104.5 125,83.5 93,83.5 ULTRA3.2
N$40  (via drill 0.35)
  Top 0.508: v18.5,19 18.5,85 v30.5,97 | v90.5,102.5 91.5,101.5 v91.5,88.5
  Bottom 0.508: v18.5,19 12,19 11.5,18.5 U$2.D7 | v30.5,97 34,100.5 46,100.5 48,102.5 v90.5,102.5 | v91.5,88.5 88.5,85.5 88.5,83 90,83 ULTRA3.5
N$41
  Top 0.508: U$2.D6 11.5,20.5 14,20.5 14,10.5 21,3.5 76.5,3.5 76.5,16.5 ULTRA4.2
N$42  (via drill 0.35)
  Top 0.508: v20,22.5 20.5,22 v20.5,8.5
  Bottom 0.508: v20,22.5 12,22.5 11.5,23 U$2.D5 | v20.5,8.5 25.5,3.5 41.5,3.5 55,17 69,17 73,21 74,21 75.5,19.5 ULTRA4.5
PWM1  (via drill 0.35)
  Top 0.508: v146,38.5 146.5,39 146.5,45 148.5,47 U$3.PWM
  Bottom 0.508: v146,38.5 116,38.5 114.5,37 87,37 84.5,34.5 U$1.2
PWM2  (via drill 0.35)
  Top 0.508: v102.5,38.5 105,41 v105,95 | v63,93.5 v66,96.5
  Bottom 0.508: v102.5,38.5 86,38.5 84.5,37 U$1.3/CANTX | v105,95 103.5,96.5 v66,96.5 | v63,93.5 62,92.5 52.5,92.5 48,88 4,88 U$4.PWM
PWM3  (via drill 0.35)
  Top 0.508: v80,43.5 77,46.5 77,84.5 72.5,89 72.5,89.5 U$5.PWM
  Bottom 0.508: v80,43.5 84,39.5 U$1.4/CANRX
PWM4  (via drill 0.35)
  Top 0.508: v125,40 134,49 v134,76.5
  Bottom 0.508: v125,40 86,40 84.5,41.5 U$1.5 | v134,76.5 137.5,80 148.5,80 U$6.PWM
PWM5  (via drill 0.35)
  Top 0.508: v40.5,22 38,24.5 38,46 35.5,48.5 v35.5,54
  Bottom 0.508: v40.5,22 46.5,28 61.5,28 65,24.5 80,24.5 80,26.5 74.5,32 71,32 69,34 U$1.23/A9 | v35.5,54 4.5,54 4,54.5 U$7.PWM

### Text on the board
tPlace: GND +12v / BATTERY | OVR ON | MOTOR ON | 2>3 / Mount | 2>3 / Mount | CMPS/Camera / Mount | CMPS/Camera / Mount | RX | TX | 5v | CMPS/Camera / Mount | CMPS/Camera / Mount | GND | 5mm / LED | + | GND | 2>3 / Mount | 2>3 / Mount | GND / / 5v / / / SDA / / SCL | USB
bPlace: FRONT / ULTRA | MOS MODULE / GND 5V SIG | Light / Gate | 3v3 | GND | VCC